# Altium schematic sheet RTC6705.SchDoc
size A4
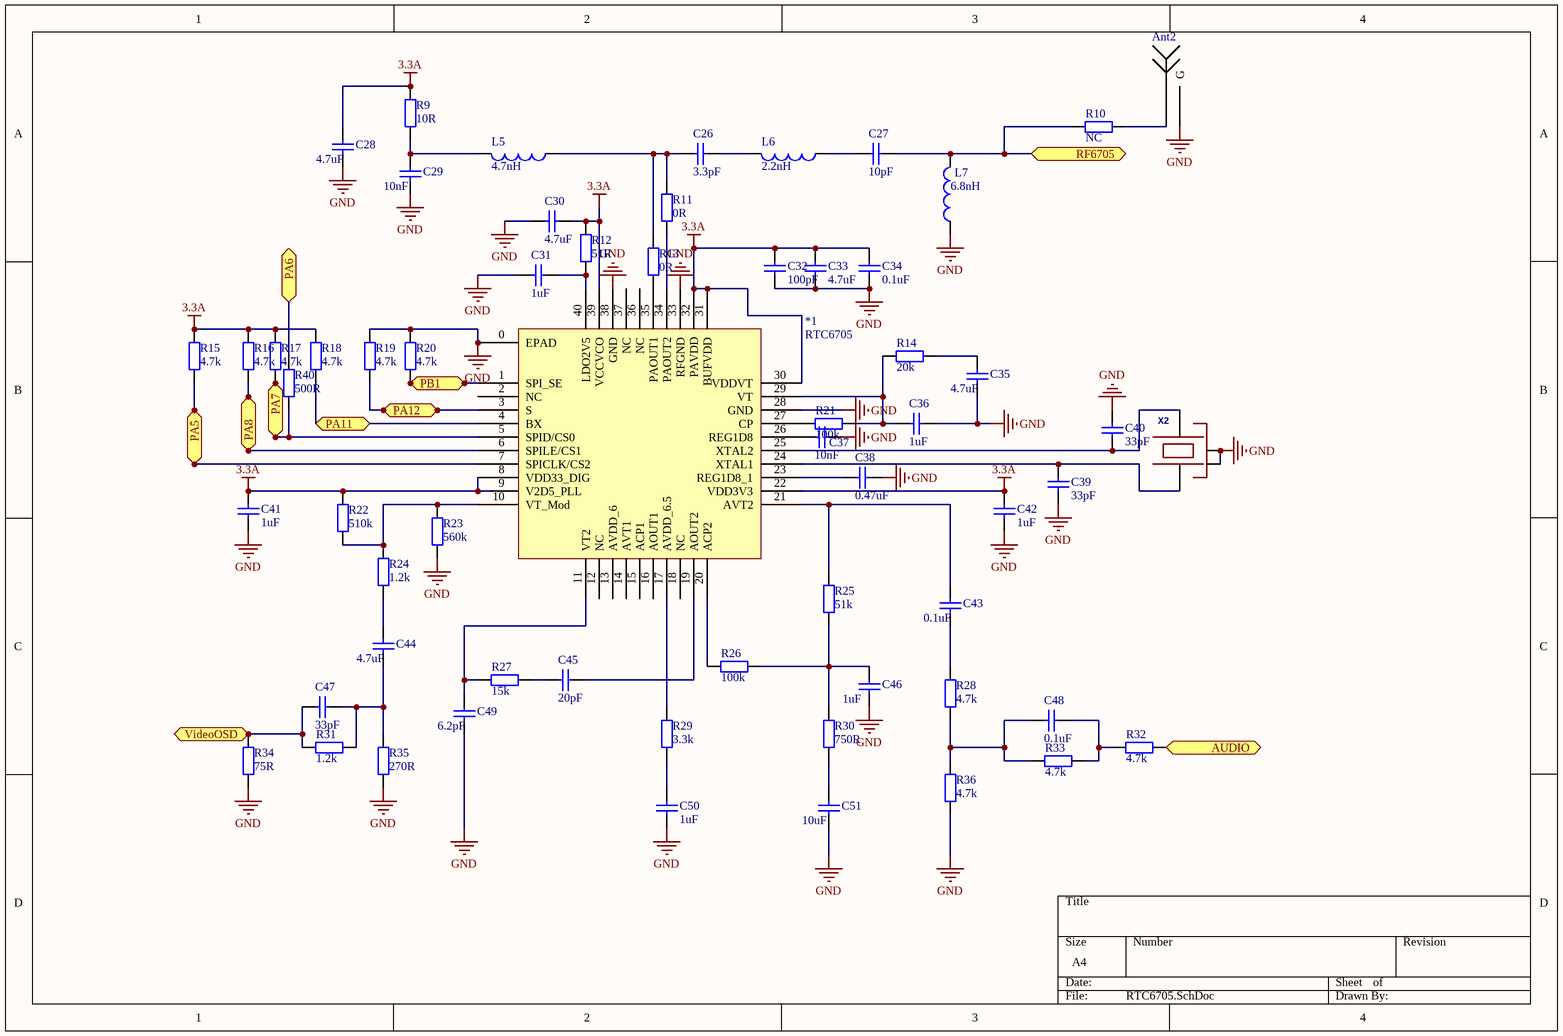
[diagram p0: RTC6705.SchDoc]

## Parts
*1  RTC6705  [RTC6705]
Ant2  Antenna  [SMA]  (value not drawn)
C26  value 3.3pF  [0402]  (hidden comment: Cap)
C27  value 10pF  [0402]  (hidden comment: Cap)
C28  value 4.7uF  [0603]  (hidden comment: Cap)
C29  value 10nF  [0402]  (hidden comment: Cap)
C30  value 4.7uF  [0402]  (hidden comment: Cap)
C31  value 1uF  [0402]  (hidden comment: Cap)
C32  value 100pF  [0402]  (hidden comment: Cap)
C33  value 4.7uF  [0402]  (hidden comment: Cap)
C34  value 0.1uF  [0402]  (hidden comment: Cap)
C35  value 4.7uF  [0402]  (hidden comment: Cap)
C36  value 1uF  [0402]  (hidden comment: Cap)
C37  value 10nF  [0402]  (hidden comment: Cap)
C38  value 0.47uF  [0402]  (hidden comment: Cap)
C39  value 33pF  [0402]  (hidden comment: Cap)
C40  value 33pF  [0402]  (hidden comment: Cap)
C41  value 1uF  [0402]  (hidden comment: Cap)
C42  value 1uF  [0402]  (hidden comment: Cap)
C43  value 0.1uF  [0402]  (hidden comment: Cap)
C44  value 4.7uF  [0402]  (hidden comment: Cap)
C45  value 20pF  [0402]  (hidden comment: Cap)
C46  value 1uF  [0402]  (hidden comment: Cap)
C47  value 33pF  [0402]  (hidden comment: Cap)
C48  value 0.1uF  [0402]  (hidden comment: Cap)
C49  value 6.2pF  [0402]  (hidden comment: Cap)
C50  value 1uF  [0402]  (hidden comment: Cap)
C51  value 10uF  [0402]  (hidden comment: Cap)
L5  value 4.7nH  [0402]  (hidden comment: Inductor)
L6  value 2.2nH  [0402]  (hidden comment: Inductor)
L7  value 6.8nH  [0402]  (hidden comment: Inductor)
R9  value 10R  [0402]  (hidden comment: Res2)
R10  value NC  [0402]  (hidden comment: Res2)
R11  value 0R  [0402]  (hidden comment: Res2)
R12  value 51R  [0402]  (hidden comment: Res2)
R13  value 0R  [0402]  (hidden comment: Res2)
R14  value 20k  [0402]  (hidden comment: Res2)
R15  value 4.7k  [0402]  (hidden comment: Res2)
R16  value 4.7k  [0402]  (hidden comment: Res2)
R17  value 4.7k  [0402]  (hidden comment: Res2)
R18  value 4.7k  [0402]  (hidden comment: Res2)
R19  value 4.7k  [0402]  (hidden comment: Res2)
R20  value 4.7k  [0402]  (hidden comment: Res2)
R21  value 100k  [0402]  (hidden comment: Res2)
R22  value 510k  [0402]  (hidden comment: Res2)
R23  value 560k  [0402]  (hidden comment: Res2)
R24  value 1.2k  [0402]  (hidden comment: Res2)
R25  value 51k  [0402]  (hidden comment: Res2)
R26  value 100k  [0402]  (hidden comment: Res2)
R27  value 15k  [0402]  (hidden comment: Res2)
R28  value 4.7k  [0402]  (hidden comment: Res2)
R29  value 3.3k  [0402]  (hidden comment: Res2)
R30  value 750R  [0402]  (hidden comment: Res2)
R31  value 1.2k  [0402]  (hidden comment: Res2)
R32  value 4.7k  [0402]  (hidden comment: Res2)
R33  value 4.7k  [0402]  (hidden comment: Res2)
R34  value 75R  [0402]  (hidden comment: Res2)
R35  value 270R  [0402]  (hidden comment: Res2)
R36  value 4.7k  [0402]  (hidden comment: Res2)
R40  value 500R  [0402]  (hidden comment: Res2)
X2  8mhz  [OSCILLATOR-3.2X2.5]  (value not drawn)

## Ports
AUDIO, PA5, PA6, PA7, PA8, PA11, PA12, PB1, RF6705, VideoOSD

## Nets
3.3A: *1.8(VDD33_DIG) *1.9(V2D5_PLL) *1.22(VDD3V3) *1.30(VDDVT) *1.31(BUFVDD) *1.32(PAVDD) *1.39(VCCVCO) C28.2 C30.2 C32.1 C33.1 C34.1 C41.1 C42.1 R9.2 R12.2 R15.2 R16.2 R17.2 R18.2 R22.2
GND: *1.0(EPAD) *1.28(GND) *1.33(RFGND) *1.38(GND) Ant2.GND(G) C28.1 C29.1 C30.1 C31.2 C32.2 C33.2 C34.2 C35.1 C36.1 C37.1 C38.1 C39.2 C40.2 C41.2 C42.2 C46.1 C49.1 C50.2 C51.1 L7.1 R19.2 R20.2 R23.1 R34.1 R35.1 R36.1 X2.2(NC_2) X2.4(NC_4)
AUDIO: R32.1 ; port AUDIO
PA5: *1.7(SPICLK/CS2) R15.1 ; port PA5
PA6: R40.2 ; port PA6
PA7: *1.5(SPID/CS0) R17.1 R40.1 ; port PA7
PA8: *1.6(SPILE/CS1) R16.1 ; port PA8
PA11: *1.4(BX) R18.1 ; port PA11
PA12: *1.3(S) R19.1 ; port PA12
PB1: *1.1(SPI_SE) R20.1 ; port PB1
RF6705: C27.1 L7.2 R10.2 ; port RF6705
VideoOSD: C47.2 R31.2 R34.2 ; port VideoOSD
Net*1_10: *1.10(VT_Mod) R22.1 R23.2 R24.2
Net*1_11: *1.11(VT2) C49.2 R27.2
Net*1_17: *1.17(AVDD_6.5) R29.1
Net*1_19: *1.19(AOUT2) C45.1
Net*1_20: *1.20(ACP2) R26.2
Net*1_21: *1.21(AVT2) C43.2 R25.2
Net*1_23: *1.23(REG1D8_1) C38.2
Net*1_24: *1.24(XTAL1) C39.1 X2.1
Net*1_25: *1.25(XTAL2) C40.1 X2.3
Net*1_26: *1.26(REG1D8) C37.2
Net*1_27: *1.27(CP) R21.2
Net*1_29: *1.29(VT) C36.2 R14.2 R21.1
Net*1_34: *1.34(PAOUT2) R11.1
Net*1_35: *1.35(PAOUT1) R13.1
Net*1_40: *1.40(LDO2V5) C31.1 R12.1
NetAnt2_1: Ant2.1 R10.1
NetC26_1: C26.1 L6.2
NetC26_2: C26.2 L5.1 R11.2 R13.2
NetC27_2: C27.2 L6.1
NetC29_2: C29.2 L5.2 R9.1
NetC35_2: C35.2 R14.1
NetC43_1: C43.1 R28.2
NetC44_1: C44.1 C47.1 R31.1 R35.2
NetC44_2: C44.2 R24.1
NetC45_2: C45.2 R27.1
NetC46_2: C46.2 R25.1 R26.1 R30.2
NetC48_1: C48.1 R32.2 R33.1
NetC48_2: C48.2 R28.1 R33.2 R36.2
NetC50_1: C50.1 R29.2
NetC51_2: C51.2 R30.1

Not connected (* = marked no-connect by the designer): *1 2(NC) 12(NC) 13(AVDD_6) 14(AVT1) 15(ACP1) 16(AOUT1) 18(NC) 36(NC) 37(NC)

## Library data of the parts
C26-C51 = Cap: Capacitor; Published: 8-Jun-2000; LatestRevisionDate: 17-Jul-2002; LatestRevisionNote: Re-released for DXP Platform.; PackageReference: RAD-0.3; Publisher: Altium Limited; PackageDescription: Radial Cap, Thru-Hole; 2 Leads; 0.3 in Pin Spacing
L5-L7 = Inductor: Code_IEC: 1005; Published: 8-Jun-2000; LatestRevisionDate: 29-May-2009; LatestRevisionNote: IPC-7351 Footprint Added.; PackageReference: 0402-A; Publisher: Altium Limited; PackageDescription: Chip Inductor; Code_JEITA: 0402
R9-R36 R40 = Res2: Resistor; Published: 8-Jun-2000; LatestRevisionDate: 17-Jul-2002; LatestRevisionNote: Re-released for DXP Platform.; PackageReference: AXIAL-0.4; Publisher: Altium Limited; PackageDescription: Axial Device, Thru-Hole; 2 Leads; 0.4 in Pin Spacing
X2 = OSCILLATOR-3.2X2.5: Crystal Oscillator in 3.2x2.5 SMD